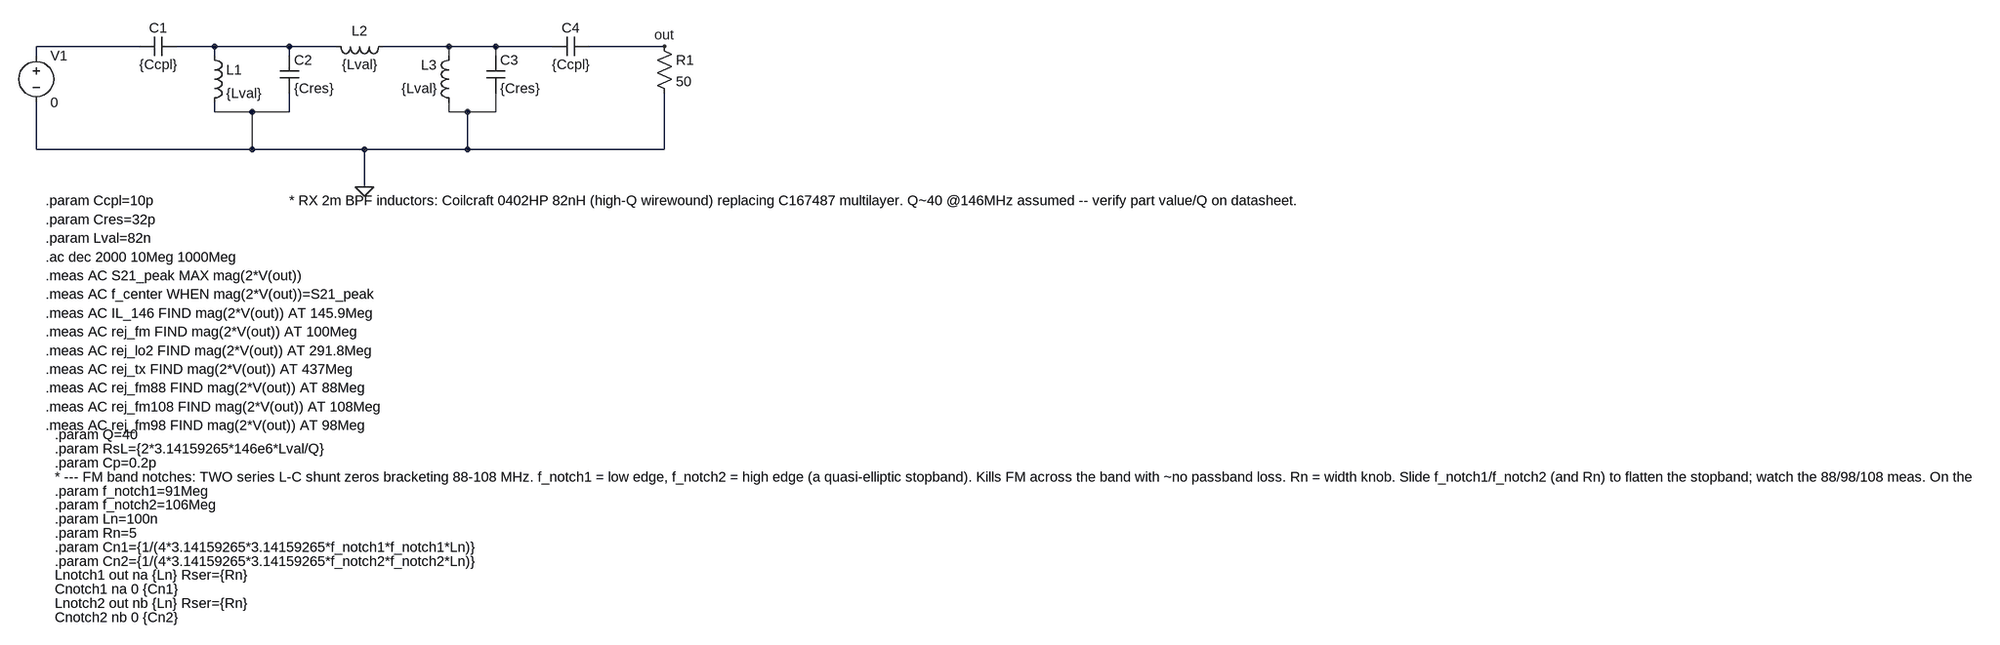
[diagram p0: schematic 146MHz_BPF_FM-reject_template.asc]
146MHz_BPF_FM-reject_template.asc, the LTspice schematic file:
Version 4.1
SHEET 1 3060 1040
WIRE 64 128 -112 128
WIRE 192 128 128 128
WIRE 320 128 192 128
WIRE 400 128 320 128
WIRE 592 128 480 128
WIRE 672 128 592 128
WIRE 768 128 672 128
WIRE 960 128 832 128
WIRE -112 144 -112 128
WIRE 192 144 192 128
WIRE 320 144 320 128
WIRE 592 144 592 128
WIRE 672 144 672 128
WIRE 192 240 192 224
WIRE 256 240 192 240
WIRE 320 240 320 208
WIRE 320 240 256 240
WIRE 592 240 592 224
WIRE 624 240 592 240
WIRE 672 240 672 208
WIRE 672 240 624 240
WIRE -112 304 -112 224
WIRE 256 304 256 240
WIRE 256 304 -112 304
WIRE 448 304 256 304
WIRE 624 304 624 240
WIRE 624 304 448 304
WIRE 960 304 960 208
WIRE 960 304 624 304
WIRE 448 368 448 304
FLAG 448 368 0
FLAG 960 128 out
SYMBOL cap 128 112 R90
WINDOW 0 0 32 VBottom 2
WINDOW 3 32 32 VTop 2
SYMATTR InstName C1
SYMATTR Value {Ccpl}
SYMBOL ind 176 128 R0
SYMATTR InstName L1
SYMATTR Value {Lval}
SYMATTR SpiceLine Rser={RsL} Cpar={Cp}
SYMBOL cap 304 144 R0
SYMATTR InstName C2
SYMATTR Value {Cres}
SYMBOL ind 496 112 R90
WINDOW 0 5 56 VBottom 2
WINDOW 3 32 56 VTop 2
SYMATTR InstName L2
SYMATTR Value {Lval}
SYMATTR SpiceLine Rser={RsL} Cpar={Cp}
SYMBOL ind 608 240 R180
WINDOW 0 36 80 Left 2
WINDOW 3 36 40 Left 2
SYMATTR InstName L3
SYMATTR Value {Lval}
SYMATTR SpiceLine Rser={RsL} Cpar={Cp}
SYMBOL cap 656 144 R0
SYMATTR InstName C3
SYMATTR Value {Cres}
SYMBOL cap 832 112 R90
WINDOW 0 0 32 VBottom 2
WINDOW 3 32 32 VTop 2
SYMATTR InstName C4
SYMATTR Value {Ccpl}
SYMBOL res 944 112 R0
SYMATTR InstName R1
SYMATTR Value 50
SYMBOL voltage -112 128 R0
SYMATTR InstName V1
SYMATTR Value 0
SYMATTR Value2 AC 1
SYMATTR SpiceLine Rser=50
TEXT -96 392 Left 2 !.param Ccpl=10p
TEXT -96 424 Left 2 !.param Cres=32p
TEXT -96 456 Left 2 !.param Lval=82n
TEXT 320 392 Left 2 !* RX 2m BPF inductors: Coilcraft 0402HP 82nH (high-Q wirewound) replacing C167487 multilayer. Q~40 @146MHz assumed -- verify part value/Q on datasheet.
TEXT -80 792 Left 2 !.param Q=40
TEXT -80 816 Left 2 !.param RsL={2*3.14159265*146e6*Lval/Q}
TEXT -80 840 Left 2 !.param Cp=0.2p
TEXT -80 864 Left 2 !* --- FM band notches: TWO series L-C shunt zeros bracketing 88-108 MHz. f_notch1 = low edge, f_notch2 = high edge (a quasi-elliptic stopband). Kills FM across the band with ~no passband loss. Rn = width knob. Slide f_notch1/f_notch2 (and Rn) to flatten the stopband; watch the 88/98/108 meas. On the board, place antenna-side (before C1). ---
TEXT -80 888 Left 2 !.param f_notch1=91Meg
TEXT -80 912 Left 2 !.param f_notch2=106Meg
TEXT -80 936 Left 2 !.param Ln=100n
TEXT -80 960 Left 2 !.param Rn=5
TEXT -80 984 Left 2 !.param Cn1={1/(4*3.14159265*3.14159265*f_notch1*f_notch1*Ln)}
TEXT -80 1008 Left 2 !.param Cn2={1/(4*3.14159265*3.14159265*f_notch2*f_notch2*Ln)}
TEXT -80 1032 Left 2 !Lnotch1 out na {Ln} Rser={Rn}
TEXT -80 1056 Left 2 !Cnotch1 na 0 {Cn1}
TEXT -80 1080 Left 2 !Lnotch2 out nb {Ln} Rser={Rn}
TEXT -80 1104 Left 2 !Cnotch2 nb 0 {Cn2}
TEXT -96 712 Left 2 !.meas AC rej_fm88 FIND mag(2*V(out)) AT 88Meg
TEXT -96 744 Left 2 !.meas AC rej_fm108 FIND mag(2*V(out)) AT 108Meg
TEXT -96 776 Left 2 !.meas AC rej_fm98 FIND mag(2*V(out)) AT 98Meg
TEXT -96 488 Left 2 !.ac dec 2000 10Meg 1000Meg
TEXT -96 520 Left 2 !.meas AC S21_peak MAX mag(2*V(out))
TEXT -96 552 Left 2 !.meas AC f_center WHEN mag(2*V(out))=S21_peak
TEXT -96 584 Left 2 !.meas AC IL_146 FIND mag(2*V(out)) AT 145.9Meg
TEXT -96 616 Left 2 !.meas AC rej_fm FIND mag(2*V(out)) AT 100Meg
TEXT -96 648 Left 2 !.meas AC rej_lo2 FIND mag(2*V(out)) AT 291.8Meg
TEXT -96 680 Left 2 !.meas AC rej_tx FIND mag(2*V(out)) AT 437Meg

The netlist it stands for:
* 146MHz_BPF_FM-reject_template.asc
C1 N002 N001 {Ccpl}
L1 N002 0 {Lval} Rser={RsL} Cpar={Cp}
C2 N002 0 {Cres}
L2 N003 N002 {Lval} Rser={RsL} Cpar={Cp}
L3 0 N003 {Lval} Rser={RsL} Cpar={Cp}
C3 N003 0 {Cres}
C4 out N003 {Ccpl}
R1 out 0 50
V1 N001 0 0 AC 1 Rser=50
.param Ccpl=10p
.param Cres=32p
.param Lval=82n
* RX 2m BPF inductors: Coilcraft 0402HP 82nH (high-Q wirewound) replacing C167487 multilayer. Q~40 @146MHz assumed -- verify part value/Q on datasheet.
.param Q=40
.param RsL={2*3.14159265*146e6*Lval/Q}
.param Cp=0.2p
* --- FM band notches: TWO series L-C shunt zeros bracketing 88-108 MHz. f_notch1 = low edge, f_notch2 = high edge (a quasi-elliptic stopband). Kills FM across the band with ~no passband loss. Rn = width knob. Slide f_notch1/f_notch2 (and Rn) to flatten the stopband; watch the 88/98/108 meas. On the board, place antenna-side (before C1). ---
.param f_notch1=91Meg
.param f_notch2=106Meg
.param Ln=100n
.param Rn=5
.param Cn1={1/(4*3.14159265*3.14159265*f_notch1*f_notch1*Ln)}
.param Cn2={1/(4*3.14159265*3.14159265*f_notch2*f_notch2*Ln)}
Lnotch1 out na {Ln} Rser={Rn}
Cnotch1 na 0 {Cn1}
Lnotch2 out nb {Ln} Rser={Rn}
Cnotch2 nb 0 {Cn2}
.meas AC rej_fm88 FIND mag(2*V(out)) AT 88Meg
.meas AC rej_fm108 FIND mag(2*V(out)) AT 108Meg
.meas AC rej_fm98 FIND mag(2*V(out)) AT 98Meg
.ac dec 2000 10Meg 1000Meg
.meas AC S21_peak MAX mag(2*V(out))
.meas AC f_center WHEN mag(2*V(out))=S21_peak
.meas AC IL_146 FIND mag(2*V(out)) AT 145.9Meg
.meas AC rej_fm FIND mag(2*V(out)) AT 100Meg
.meas AC rej_lo2 FIND mag(2*V(out)) AT 291.8Meg
.meas AC rej_tx FIND mag(2*V(out)) AT 437Meg
.backanno
.end